# EasyEDA Pro project EctoControlAdapter.eprj

# Schematic EctoControlAdapter
Board Name: EctoControlAdapter; Create Date: 2025-11-25; Page Name: Sheet_1; Project Name: EctoControlAdapter3; Schematic Name: EctoControlAdapter; Update Date: 2025-11-25; Add into BOM: yes; Company: m039; Convert to PCB: yes; Date: 2025-04-24; Draw By: Dmitry Mozgin; REV: 1.0; Sheet: 1/1
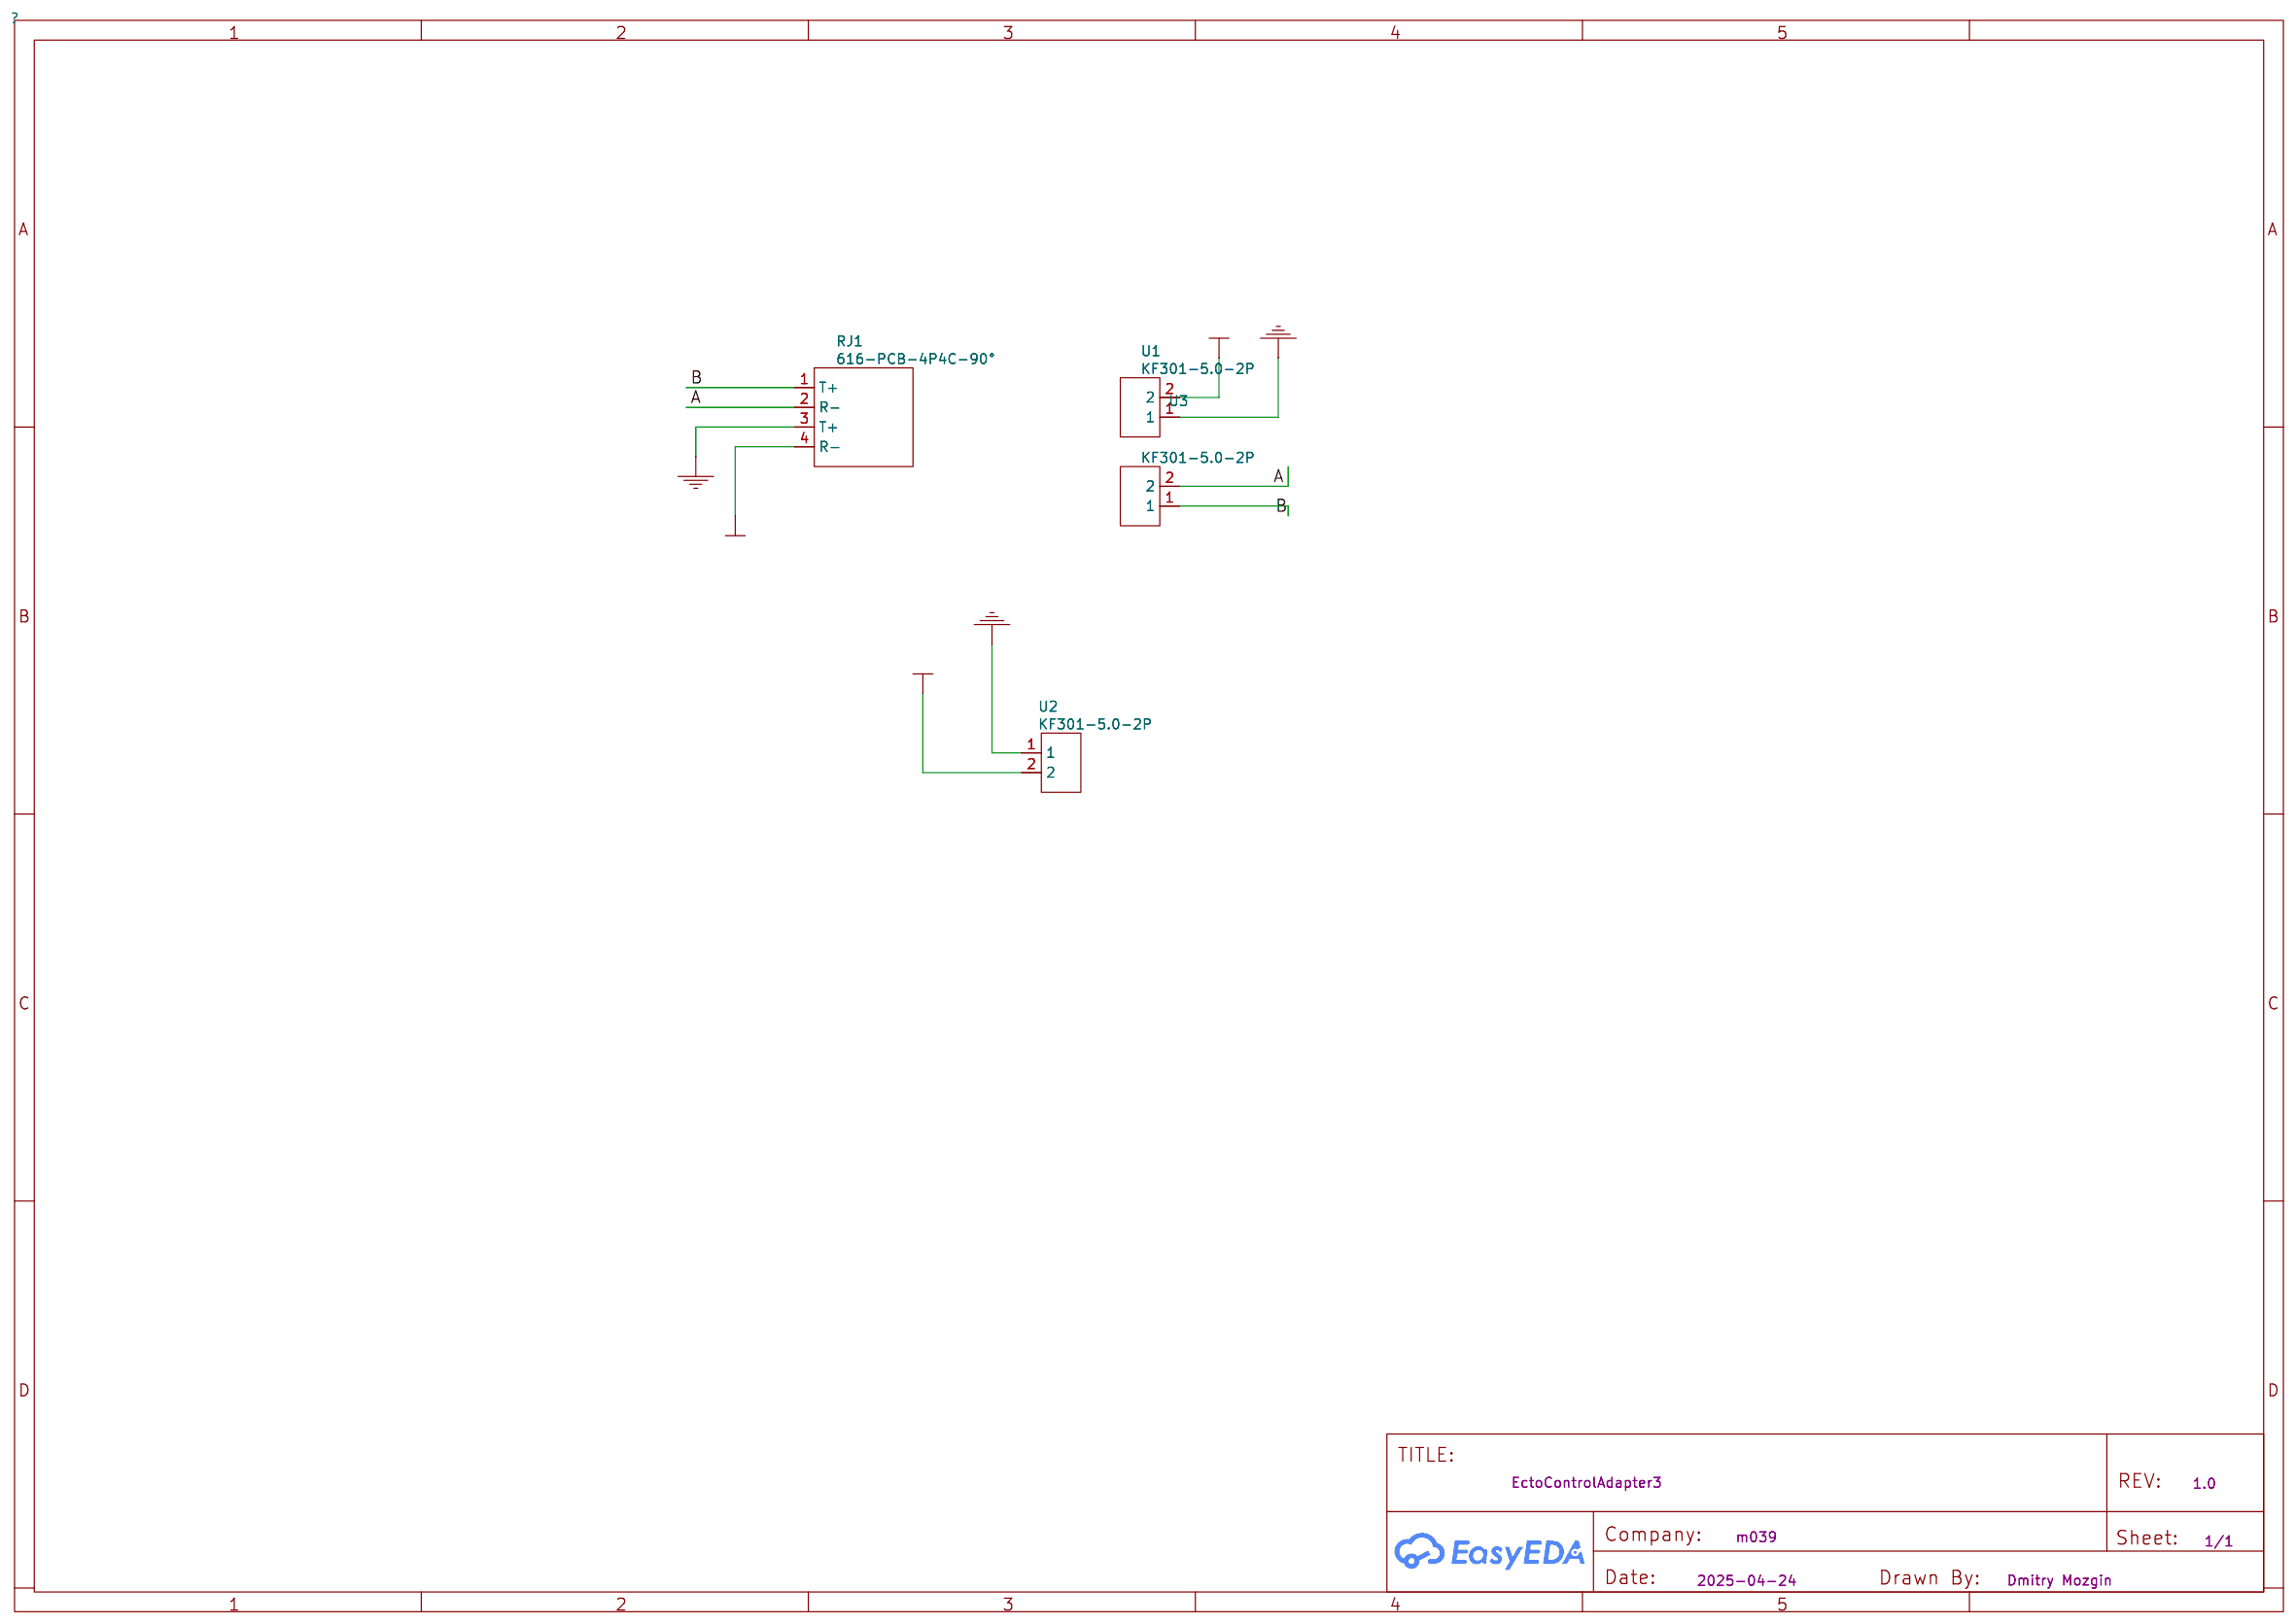
[diagram p0: schematic sheet]

## Parts
RJ1  616-PCB-4P4C-90°  [RJ11-TH_616-PCB-4P4C-90]
U1  KF301-5.0-2P  [CONN-TH_P5.00_KF301-5.0-2P]
U2  KF301-5.0-2P  [CONN-TH_P5.00_KF301-5.0-2P]
U3  KF301-5.0-2P  [CONN-TH_P5.00_KF301-5.0-2P]

## Library data of the parts
RJ1 = 616-PCB-4P4C-90°: Supplier: LCSC; Supplier Part: C189737; Manufacturer: Ckmtw(灿科盟); Manufacturer Part: R-RJ11R04P-A802; JLCPCB Part Class: Extended Part
U1-U3 = KF301-5.0-2P: Supplier: LCSC; Supplier Part: C474881; Manufacturer: KEFA(科发); JLCPCB Part Class: Extended Part

## Nets
GND: RJ1.3(T+) U1.1 U2.1
VCC: RJ1.4(R-) U1.2 U2.2
A: RJ1.2(R-) U3.2
B: RJ1.1(T+) U3.1

# Board PCB_EctoControlAdapter
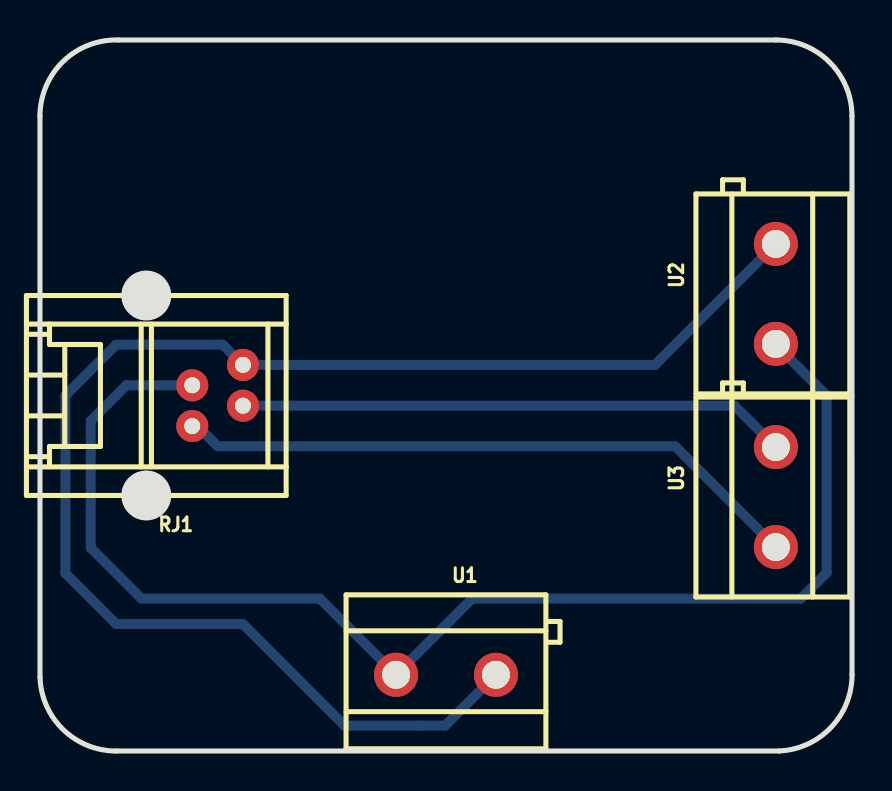
[diagram p1: board, top side]
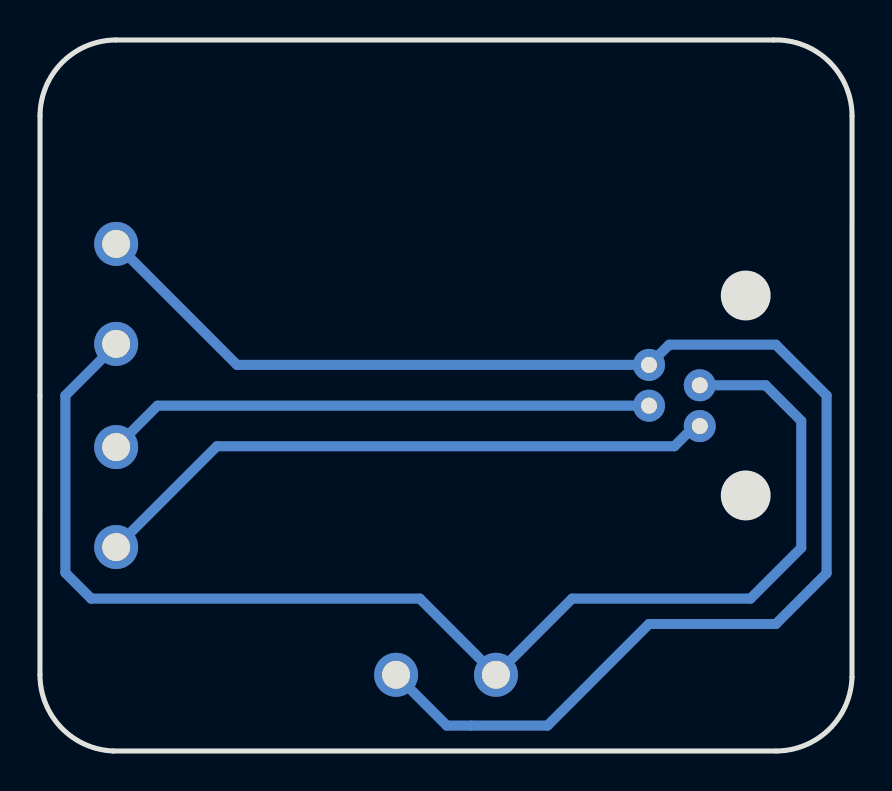
[diagram p2: board, bottom side, seen from below]

Outline 40.65 x 35.56 mm; copper layers: Top Layer, Bottom Layer. Coordinates in mm from the lower left corner of the outline.
Outline path: 0,31.76 arc(1.16,34.49) 3.93,35.56 36.83,35.56 arc(39.53,34.45) 40.64,31.75 40.64,17.78 40.65,3.81 arc(39.59,1.17) 37,0 3.81,0 arc(1.16,1.08) 0,3.7 0,31.76

## Placement (name value [footprint] x y rotation side)
RJ1  616-PCB-4P4C-90°  [RJ11-TH_616-PCB-4P4C-90]  8.89 17.78 180 top
U1  KF301-5.0-2P  [CONN-TH_P5.00_KF301-5.0-2P]  20.32 3.81 0 top
U2  KF301-5.0-2P  [CONN-TH_P5.00_KF301-5.0-2P]  36.83 22.86 90 top
U3  KF301-5.0-2P  [CONN-TH_P5.00_KF301-5.0-2P]  36.83 12.7 90 top

## Footprints (pads in the part's own frame, mm; a bottom-side part is the same pattern mirrored in y, then rotated)
CONN-TH_P5.00_KF301-5.0-2P
  round 2.2 hole 1.4: 1(-2.5,0) 2(2.5,0)
RJ11-TH_616-PCB-4P4C-90
  round 1.6 hole 0.8: 1(1.27,1.53) 2(-1.27,0.51) 3(1.27,-0.51) 4(-1.27,-1.53)

## Nets
As in the schematic.

## Routing (per net, layer and track width the routed paths; a pad name or vN(x,y) marks a point on that pad's centre or on a via; arc(x,y) is an arc through that point)
GND: length 66.2
  Bottom Layer w0.5: U2.1 36.83,20.32 39.37,17.78 39.37,8.91 38.08,7.62 21.63,7.62 U1.1 14.01,7.62 5.08,7.62 2.54,10.16 2.54,16.51 4.32,18.29 RJ1.3
VCC: length 74.2
  Bottom Layer w0.5: 10.16,19.31 9.15,20.32 3.81,20.32 1.27,17.78 1.27,8.89 3.81,6.35 10.16,6.35 15.24,1.27 20.28,1.27 U1.2 ; RJ1.4 30.78,19.31 U2.2
A: length 27.5
  Bottom Layer w0.5: U3.2 34.76,17.27 RJ1.2
B: length 31.7
  Bottom Layer w0.5: U3.1 31.79,15.24 8.89,15.24 7.88,16.25 RJ1.1
